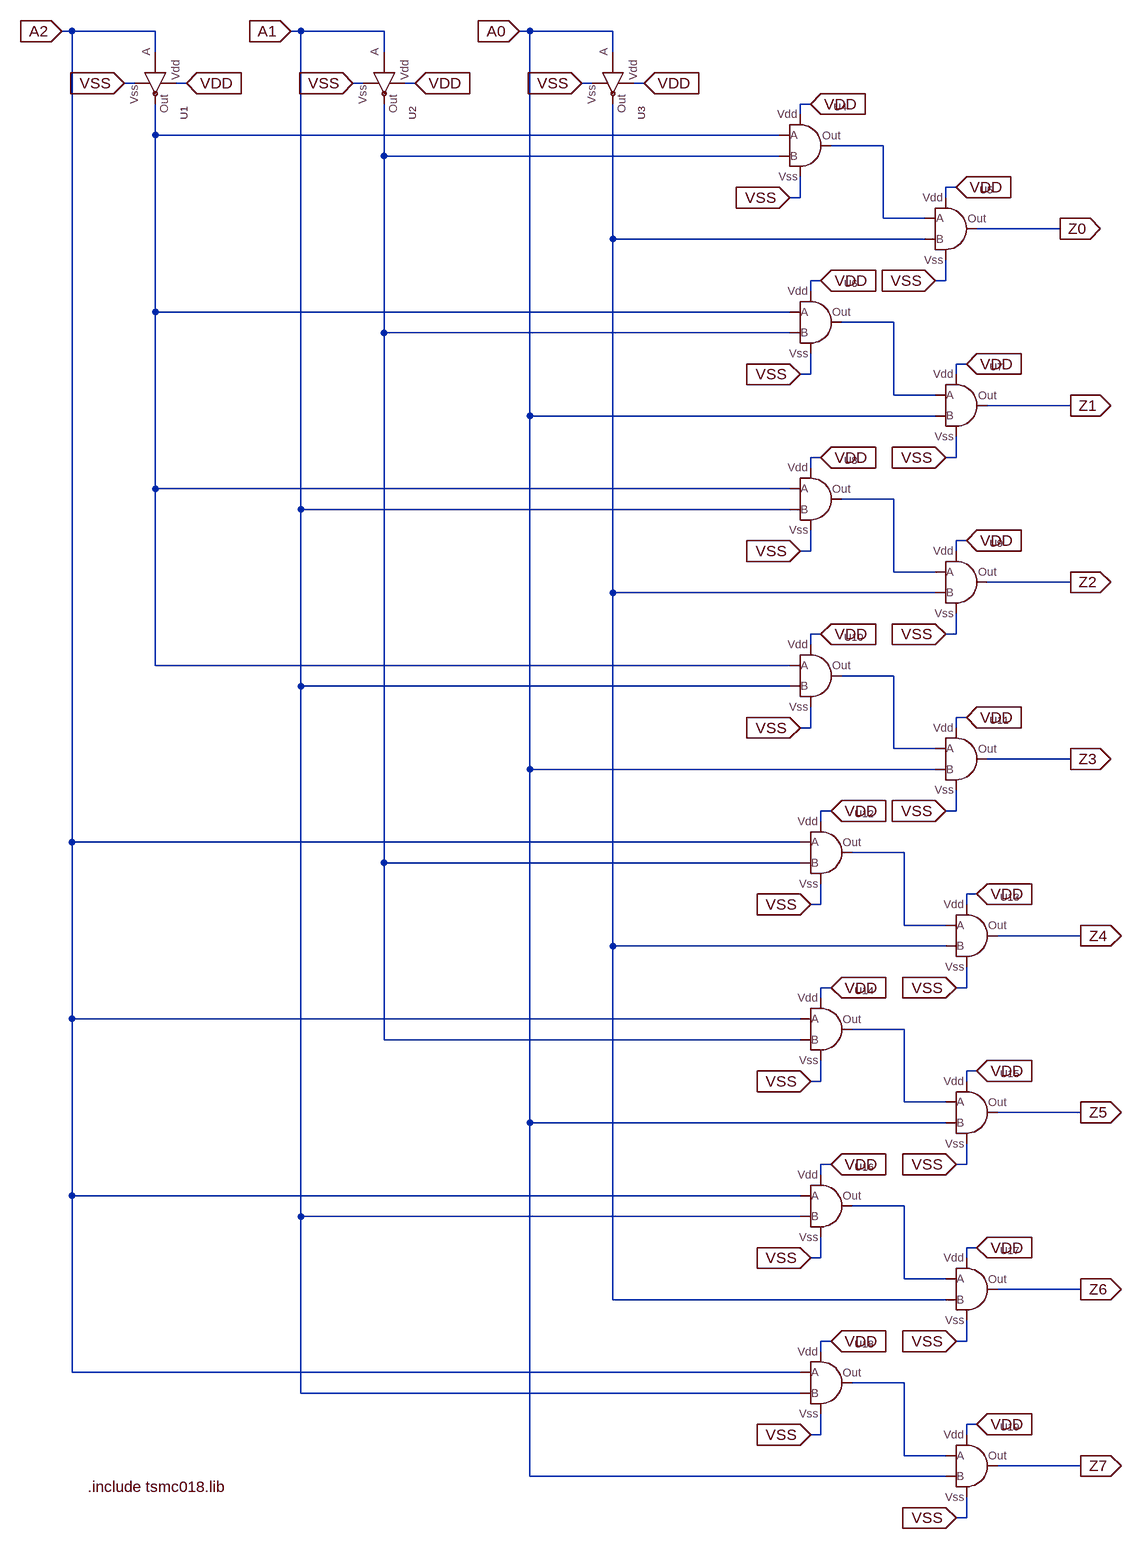
[diagram p0: schematic 3_to_8_Row_Decoder.asc]
3_to_8_Row_Decoder.asc, the LTspice schematic file:
Version 4.1
SHEET 1 1688 2856
WIRE 16 16 0 16
WIRE 144 16 16 16
WIRE 368 16 352 16
WIRE 496 16 368 16
WIRE 720 16 704 16
WIRE 848 16 720 16
WIRE 144 48 144 16
WIRE 496 48 496 16
WIRE 848 48 848 16
WIRE 112 96 96 96
WIRE 192 96 176 96
WIRE 464 96 448 96
WIRE 544 96 528 96
WIRE 816 96 800 96
WIRE 896 96 880 96
WIRE 1152 128 1136 128
WIRE 1136 144 1136 128
WIRE 144 176 144 128
WIRE 1104 176 144 176
WIRE 1264 192 1184 192
WIRE 496 208 496 128
WIRE 1104 208 496 208
WIRE 1376 256 1360 256
WIRE 1136 272 1136 240
WIRE 1136 272 1120 272
WIRE 1360 272 1360 256
WIRE 1264 304 1264 192
WIRE 1328 304 1264 304
WIRE 1536 320 1408 320
WIRE 848 336 848 128
WIRE 1328 336 848 336
WIRE 1168 400 1152 400
WIRE 1360 400 1360 368
WIRE 1360 400 1344 400
WIRE 1152 416 1152 400
WIRE 144 448 144 176
WIRE 1120 448 144 448
WIRE 1280 464 1200 464
WIRE 496 480 496 208
WIRE 1120 480 496 480
WIRE 1392 528 1376 528
WIRE 1152 544 1152 512
WIRE 1152 544 1136 544
WIRE 1376 544 1376 528
WIRE 1280 576 1280 464
WIRE 1344 576 1280 576
WIRE 1552 592 1424 592
WIRE 720 608 720 16
WIRE 1344 608 720 608
WIRE 1168 672 1152 672
WIRE 1376 672 1376 640
WIRE 1376 672 1360 672
WIRE 1152 688 1152 672
WIRE 144 720 144 448
WIRE 1120 720 144 720
WIRE 1280 736 1200 736
WIRE 368 752 368 16
WIRE 1120 752 368 752
WIRE 1392 800 1376 800
WIRE 1152 816 1152 784
WIRE 1152 816 1136 816
WIRE 1376 816 1376 800
WIRE 1280 848 1280 736
WIRE 1344 848 1280 848
WIRE 1552 864 1424 864
WIRE 848 880 848 336
WIRE 1344 880 848 880
WIRE 1168 944 1152 944
WIRE 1376 944 1376 912
WIRE 1376 944 1360 944
WIRE 1152 960 1152 944
WIRE 144 992 144 720
WIRE 1120 992 144 992
WIRE 1280 1008 1200 1008
WIRE 368 1024 368 752
WIRE 1120 1024 368 1024
WIRE 1392 1072 1376 1072
WIRE 1152 1088 1152 1056
WIRE 1152 1088 1136 1088
WIRE 1376 1088 1376 1072
WIRE 1280 1120 1280 1008
WIRE 1344 1120 1280 1120
WIRE 1552 1136 1424 1136
WIRE 720 1152 720 608
WIRE 1344 1152 720 1152
WIRE 1184 1216 1168 1216
WIRE 1376 1216 1376 1184
WIRE 1376 1216 1360 1216
WIRE 1168 1232 1168 1216
WIRE 16 1264 16 16
WIRE 1136 1264 16 1264
WIRE 1296 1280 1216 1280
WIRE 496 1296 496 480
WIRE 1136 1296 496 1296
WIRE 1408 1344 1392 1344
WIRE 1168 1360 1168 1328
WIRE 1168 1360 1152 1360
WIRE 1392 1360 1392 1344
WIRE 1296 1392 1296 1280
WIRE 1360 1392 1296 1392
WIRE 1568 1408 1440 1408
WIRE 848 1424 848 880
WIRE 1360 1424 848 1424
WIRE 1184 1488 1168 1488
WIRE 1392 1488 1392 1456
WIRE 1392 1488 1376 1488
WIRE 1168 1504 1168 1488
WIRE 16 1536 16 1264
WIRE 1136 1536 16 1536
WIRE 1296 1552 1216 1552
WIRE 496 1568 496 1296
WIRE 1136 1568 496 1568
WIRE 1408 1616 1392 1616
WIRE 1168 1632 1168 1600
WIRE 1168 1632 1152 1632
WIRE 1392 1632 1392 1616
WIRE 1296 1664 1296 1552
WIRE 1360 1664 1296 1664
WIRE 1568 1680 1440 1680
WIRE 720 1696 720 1152
WIRE 1360 1696 720 1696
WIRE 1184 1760 1168 1760
WIRE 1392 1760 1392 1728
WIRE 1392 1760 1376 1760
WIRE 1168 1776 1168 1760
WIRE 16 1808 16 1536
WIRE 1136 1808 16 1808
WIRE 1296 1824 1216 1824
WIRE 368 1840 368 1024
WIRE 1136 1840 368 1840
WIRE 1408 1888 1392 1888
WIRE 1168 1904 1168 1872
WIRE 1168 1904 1152 1904
WIRE 1392 1904 1392 1888
WIRE 1296 1936 1296 1824
WIRE 1360 1936 1296 1936
WIRE 1568 1952 1440 1952
WIRE 848 1968 848 1424
WIRE 1360 1968 848 1968
WIRE 1184 2032 1168 2032
WIRE 1392 2032 1392 2000
WIRE 1392 2032 1376 2032
WIRE 1168 2048 1168 2032
WIRE 16 2080 16 1808
WIRE 1136 2080 16 2080
WIRE 1296 2096 1216 2096
WIRE 368 2112 368 1840
WIRE 1136 2112 368 2112
WIRE 1408 2160 1392 2160
WIRE 1168 2176 1168 2144
WIRE 1168 2176 1152 2176
WIRE 1392 2176 1392 2160
WIRE 1296 2208 1296 2096
WIRE 1360 2208 1296 2208
WIRE 1568 2224 1440 2224
WIRE 720 2240 720 1696
WIRE 1360 2240 720 2240
WIRE 1392 2304 1392 2272
WIRE 1392 2304 1376 2304
FLAG 96 96 VSS
IOPIN 96 96 In
FLAG 448 96 VSS
IOPIN 448 96 In
FLAG 800 96 VSS
IOPIN 800 96 In
FLAG 192 96 VDD
IOPIN 192 96 In
FLAG 544 96 VDD
IOPIN 544 96 In
FLAG 896 96 VDD
IOPIN 896 96 In
FLAG 0 16 A2
IOPIN 0 16 In
FLAG 352 16 A1
IOPIN 352 16 In
FLAG 704 16 A0
IOPIN 704 16 In
FLAG 1120 272 VSS
IOPIN 1120 272 In
FLAG 1344 400 VSS
IOPIN 1344 400 In
FLAG 1152 128 VDD
IOPIN 1152 128 In
FLAG 1376 256 VDD
IOPIN 1376 256 In
FLAG 1536 320 Z0
IOPIN 1536 320 Out
FLAG 1136 544 VSS
IOPIN 1136 544 In
FLAG 1360 672 VSS
IOPIN 1360 672 In
FLAG 1168 400 VDD
IOPIN 1168 400 In
FLAG 1392 528 VDD
IOPIN 1392 528 In
FLAG 1552 592 Z1
IOPIN 1552 592 Out
FLAG 1136 816 VSS
IOPIN 1136 816 In
FLAG 1360 944 VSS
IOPIN 1360 944 In
FLAG 1168 672 VDD
IOPIN 1168 672 In
FLAG 1392 800 VDD
IOPIN 1392 800 In
FLAG 1552 864 Z2
IOPIN 1552 864 Out
FLAG 1136 1088 VSS
IOPIN 1136 1088 In
FLAG 1360 1216 VSS
IOPIN 1360 1216 In
FLAG 1168 944 VDD
IOPIN 1168 944 In
FLAG 1392 1072 VDD
IOPIN 1392 1072 In
FLAG 1552 1136 Z3
IOPIN 1552 1136 Out
FLAG 1152 1360 VSS
IOPIN 1152 1360 In
FLAG 1376 1488 VSS
IOPIN 1376 1488 In
FLAG 1184 1216 VDD
IOPIN 1184 1216 In
FLAG 1408 1344 VDD
IOPIN 1408 1344 In
FLAG 1568 1408 Z4
IOPIN 1568 1408 Out
FLAG 1152 1632 VSS
IOPIN 1152 1632 In
FLAG 1376 1760 VSS
IOPIN 1376 1760 In
FLAG 1184 1488 VDD
IOPIN 1184 1488 In
FLAG 1408 1616 VDD
IOPIN 1408 1616 In
FLAG 1568 1680 Z5
IOPIN 1568 1680 Out
FLAG 1152 1904 VSS
IOPIN 1152 1904 In
FLAG 1376 2032 VSS
IOPIN 1376 2032 In
FLAG 1184 1760 VDD
IOPIN 1184 1760 In
FLAG 1408 1888 VDD
IOPIN 1408 1888 In
FLAG 1568 1952 Z6
IOPIN 1568 1952 Out
FLAG 1152 2176 VSS
IOPIN 1152 2176 In
FLAG 1376 2304 VSS
IOPIN 1376 2304 In
FLAG 1184 2032 VDD
IOPIN 1184 2032 In
FLAG 1408 2160 VDD
IOPIN 1408 2160 In
FLAG 1568 2224 Z7
IOPIN 1568 2224 Out
SYMBOL 200207032_Nida_Mert_NOT_GATE\\NOT1 144 80 R90
SYMATTR InstName U1
SYMBOL 200207032_Nida_Mert_NOT_GATE\\NOT1 496 80 R90
SYMATTR InstName U2
SYMBOL 200207032_Nida_Mert_NOT_GATE\\NOT1 848 80 R90
SYMATTR InstName U3
SYMBOL 200207032_Nida_Mert_AND_GATE\\AND1 1120 192 R0
SYMATTR InstName U4
SYMBOL 200207032_Nida_Mert_AND_GATE\\AND1 1344 320 R0
SYMATTR InstName U5
SYMBOL 200207032_Nida_Mert_AND_GATE\\AND1 1136 464 R0
SYMATTR InstName U6
SYMBOL 200207032_Nida_Mert_AND_GATE\\AND1 1360 592 R0
SYMATTR InstName U7
SYMBOL 200207032_Nida_Mert_AND_GATE\\AND1 1136 736 R0
SYMATTR InstName U8
SYMBOL 200207032_Nida_Mert_AND_GATE\\AND1 1360 864 R0
SYMATTR InstName U9
SYMBOL 200207032_Nida_Mert_AND_GATE\\AND1 1136 1008 R0
SYMATTR InstName U10
SYMBOL 200207032_Nida_Mert_AND_GATE\\AND1 1360 1136 R0
SYMATTR InstName U11
SYMBOL 200207032_Nida_Mert_AND_GATE\\AND1 1152 1280 R0
SYMATTR InstName U12
SYMBOL 200207032_Nida_Mert_AND_GATE\\AND1 1376 1408 R0
SYMATTR InstName U13
SYMBOL 200207032_Nida_Mert_AND_GATE\\AND1 1152 1552 R0
SYMATTR InstName U14
SYMBOL 200207032_Nida_Mert_AND_GATE\\AND1 1376 1680 R0
SYMATTR InstName U15
SYMBOL 200207032_Nida_Mert_AND_GATE\\AND1 1152 1824 R0
SYMATTR InstName U16
SYMBOL 200207032_Nida_Mert_AND_GATE\\AND1 1376 1952 R0
SYMATTR InstName U17
SYMBOL 200207032_Nida_Mert_AND_GATE\\AND1 1152 2096 R0
SYMATTR InstName U18
SYMBOL 200207032_Nida_Mert_AND_GATE\\AND1 1376 2224 R0
SYMATTR InstName U19
TEXT 40 2256 Left 2 !.include tsmc018.lib

The netlist it stands for:
* 3_to_8_Row_Decoder.asc
X§U1 VDD VSS A2 N001 NOT1  ; pins Vdd Vss A Out
X§U2 VDD VSS A1 N003 NOT1  ; pins Vdd Vss A Out
X§U3 VDD VSS A0 N004 NOT1  ; pins Vdd Vss A Out
X§U4 VDD VSS N001 N003 N002 AND1  ; pins Vdd Vss A B Out
X§U5 VDD VSS N002 N004 Z0 AND1  ; pins Vdd Vss A B Out
X§U6 VDD VSS N001 N003 N005 AND1  ; pins Vdd Vss A B Out
X§U7 VDD VSS N005 A0 Z1 AND1  ; pins Vdd Vss A B Out
X§U8 VDD VSS N001 A1 N006 AND1  ; pins Vdd Vss A B Out
X§U9 VDD VSS N006 N004 Z2 AND1  ; pins Vdd Vss A B Out
X§U10 VDD VSS N001 A1 N007 AND1  ; pins Vdd Vss A B Out
X§U11 VDD VSS N007 A0 Z3 AND1  ; pins Vdd Vss A B Out
X§U12 VDD VSS A2 N003 N008 AND1  ; pins Vdd Vss A B Out
X§U13 VDD VSS N008 N004 Z4 AND1  ; pins Vdd Vss A B Out
X§U14 VDD VSS A2 N003 N009 AND1  ; pins Vdd Vss A B Out
X§U15 VDD VSS N009 A0 Z5 AND1  ; pins Vdd Vss A B Out
X§U16 VDD VSS A2 A1 N010 AND1  ; pins Vdd Vss A B Out
X§U17 VDD VSS N010 N004 Z6 AND1  ; pins Vdd Vss A B Out
X§U18 VDD VSS A2 A1 N011 AND1  ; pins Vdd Vss A B Out
X§U19 VDD VSS N011 A0 Z7 AND1  ; pins Vdd Vss A B Out
.include tsmc018.lib
.lib NOT1.sub
.lib AND1.sub
.backanno
.end